# Altium project PCB_Project.PrjPcb
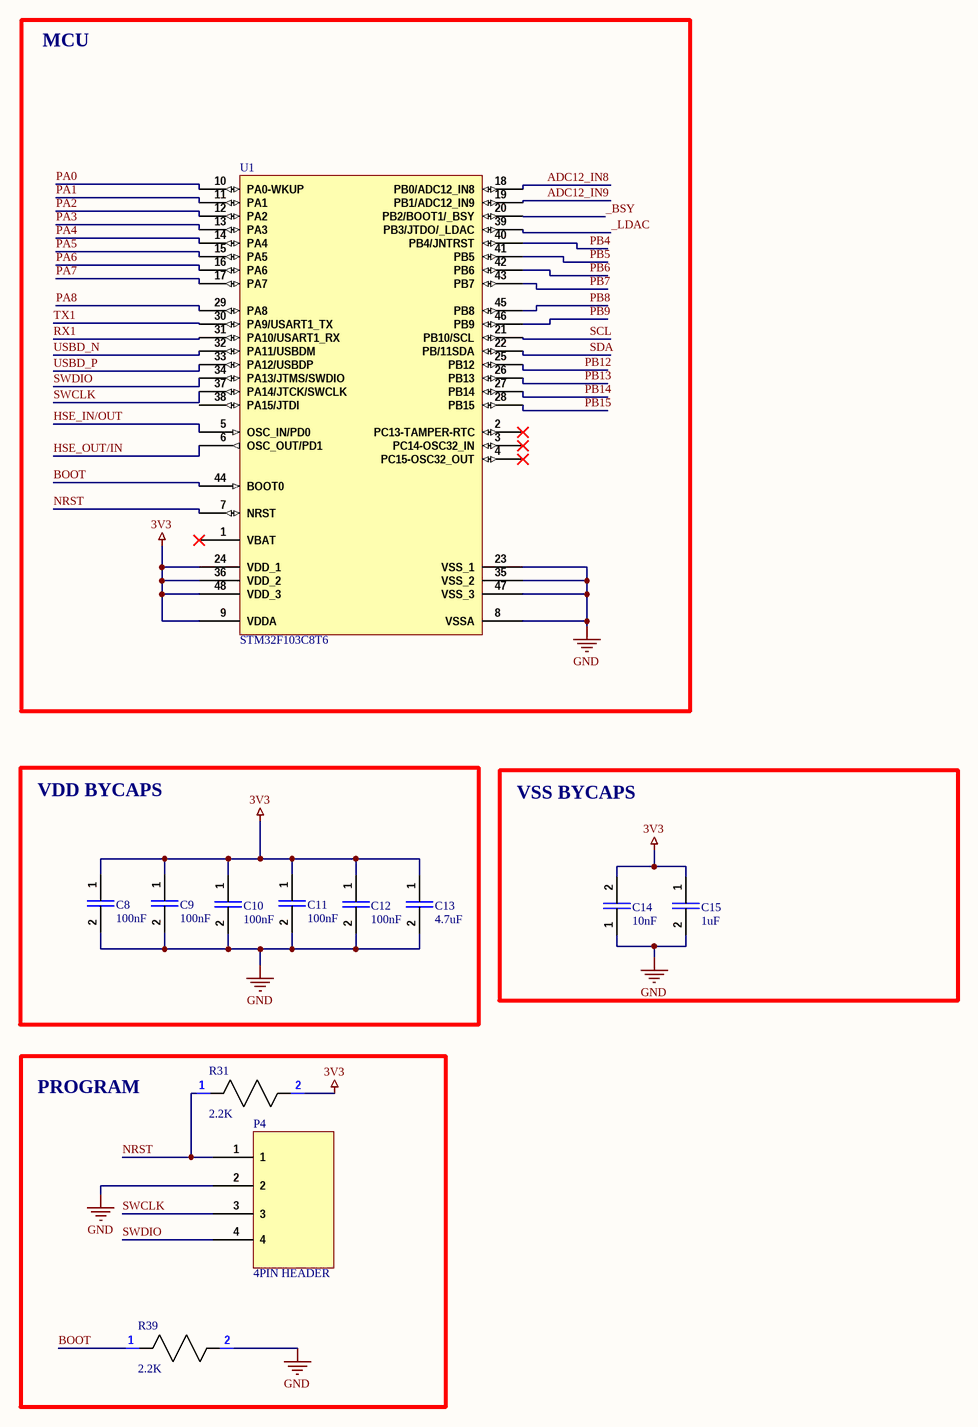
[diagram p0: MCU.SchDoc]
8 sheets, 153 parts. Net scope: global (net labels, ports and power ports of the same name join across sheets).
Board file: PCB1.PcbDoc
Sheets:
  MCU.SchDoc
  Power.SchDoc
  Oscillators.SchDoc
  RS232.SchDoc
  USB.SchDoc
  ADC.SchDoc
  DAC.SchDoc
  GPIO.SchDoc

## Sheet MCU.SchDoc
size A3; SheetNumber: 1; SheetTotal: 8

### Parts
C8  value 100nF  [0603 Cap]  (hidden comment: 0603 Capacitor)
C9  value 100nF  [0603 Cap]  (hidden comment: 0603 Capacitor)
C10  value 100nF  [0603 Cap]  (hidden comment: 0603 Capacitor)
C11  value 100nF  [0603 Cap]  (hidden comment: 0603 Capacitor)
C12  value 100nF  [0603 Cap]  (hidden comment: 0603 Capacitor)
C13  value 4.7uF  [0603 Cap]  (hidden comment: 0603 Capacitor)
C14  value 10nF  [0603 Cap]  (hidden comment: 0603 Capacitor)
C15  value 1uF  [0603 Cap]  (hidden comment: 0603 Capacitor)
P4  4PIN HEADER  [SM04B-SRSS-TB]
R31  value 2.2K  [0603 RES]  (hidden comment: Resistor)
R39  value 2.2K  [0603 RES]  (hidden comment: Resistor)
U1  STM32F103C8T6  [LQFP48_N]

### Blocks framed on the sheet
MCU: U1
VDD BYCAPS: C8-C13
VSS BYCAPS: C14 C15
PROGRAM: P4 R31 R39

### Nets
3V3: C8.1 C9.1 C10.1 C11.1 C12.1 C13.1 C14.2 C15.1 R31.2 U1.9(VDDA) U1.24(VDD_1) U1.36(VDD_2) U1.48(VDD_3)
GND: C8.2 C9.2 C10.2 C11.2 C12.2 C13.2 C14.1 C15.2 P4.2 R39.2 U1.8(VSSA) U1.23(VSS_1) U1.35(VSS_2) U1.47(VSS_3)
_BSY: U1.20(PB2/BOOT1/_BSY)
_LDAC: U1.39(PB3/JTDO/_LDAC)
ADC12_IN8: U1.18(PB0/ADC12_IN8)
ADC12_IN9: U1.19(PB1/ADC12_IN9)
BOOT: R39.1 U1.44(BOOT0)
HSE_IN/OUT: U1.5(OSC_IN/PD0)
HSE_OUT/IN: U1.6(OSC_OUT/PD1)
NRST: P4.1 R31.1 U1.7(NRST)
PA0: U1.10(PA0-WKUP)
PA1: U1.11(PA1)
PA2: U1.12(PA2)
PA3: U1.13(PA3)
PA4: U1.14(PA4)
PA5: U1.15(PA5)
PA6: U1.16(PA6)
PA7: U1.17(PA7)
PA8: U1.29(PA8)
PB4: U1.40(PB4/JNTRST)
PB5: U1.41(PB5)
PB6: U1.42(PB6)
PB7: U1.43(PB7)
PB8: U1.45(PB8)
PB9: U1.46(PB9)
PB12: U1.25(PB12)
PB13: U1.26(PB13)
PB14: U1.27(PB14)
PB15: U1.28(PB15)
RX1: U1.31(PA10/USART1_RX)
SCL: U1.21(PB10/SCL)
SDA: U1.22(PB/11SDA)
SWCLK: P4.3 U1.37(PA14/JTCK/SWCLK)
SWDIO: P4.4 U1.34(PA13/JTMS/SWDIO)
TX1: U1.30(PA9/USART1_TX)
USBD_N: U1.32(PA11/USBDM)
USBD_P: U1.33(PA12/USBDP)

Not connected (* = marked no-connect by the designer): U1 1(VBAT)* 2(PC13-TAMPER-RTC)* 3(PC14-OSC32_IN)* 4(PC15-OSC32_OUT)* 38(PA15/JTDI)

### Library data of the parts
C8-C15 = 0603 Cap: SMD 0603 (ceramic) capacitor; Manufacturer: Murata; Manufacturer Part Number: GRM21BR71C225KA12L; Multilayer: Yes; Tolerance  (fill in as +-): 10%; Rated DC Voltage (URdc): 16V; Temperature Characteristics Code: X7R; Supplier: Mouser; Supplier Part Number: 81-GRM21BR71C225KA2L; RoHS: Yes; Category: Ceramic Capacitors; Stock: 30148; Pricing: 1=0,3, 10=0,163, 50=0,163, 100=0,098, 1000=0,07, 10000=0,054 (USD); Mounting Technology: Surface Mount; Pins: 2; Package Shape: Rectangular; Terminal Finish: Nickel; Dielectric Material: Ceramic; Case/Package: 0805; Min Operating Temperature: -55°C; Max Operating Temperature: 125°C; JESD-609 Code: e3; Package Style: SMTMeter; Capacitor Type: Ceramic; Packaging: Tape and Reel; Tolerance (fill in as +-): 10%; Termination: Wraparound; Length: 2mm; Width: 1.25mm; Height: 1.25mm; Reach SVHC Compliant: Yes; RoHS Compliant: Yes; ComponentLink1URL: https://datasheet.ciiva.com:443/pdfs/VipMasterIC/IC/MURE/MURE-S-A0004349797/MURE-S-A0004361718-1.pdf?src-supplier=IHS+Markit; ComponentLink1Description: https://datasheet.ciiva.com:443/pdfs/VipMasterIC/IC/MURE/MURE-S-A0004349797/MURE-S-A0004361718-1.pdf?src-supplier=IHS+Markit; ComponentLink2URL: https://datasheet.ciiva.com/7937/608985-7937701.pdf?src-supplier=Element14; ComponentLink2Description: https://datasheet.ciiva.com/7937/608985-7937701.pdf?src-supplier=Element14
P4 = 4X HEADER
R31 R39 = 0603 Res: Can be used for SMD resistors
U1 = STM32F103C8T6: STM32 ARM-based 32-bit MCU with 64 Kbytes Flash, 48-pin LQFP, Industrial Temperature; Published: 30-May-2008; DatasheetVersion: rev6, Mar-2008; PackageVersion: Mar-2008; PackageReference: LQFP48; Publisher: Altium Limited; PackageDescription: 48-Pin Low-Profile Quad Flat Pack, 7 x 7 mm Body, 0.5 mm Pitch (LQFP48); ComponentLink1Description: Manufacturer Link; ComponentLink1URL: www.st.com/stm32; ComponentLink2Description: Datasheet; ComponentLink2URL: http://www.st.com/stonline/products/literature/ds/13587.pdf

## Sheet Power.SchDoc
size A4; SheetNumber: 2; SheetTotal: 8
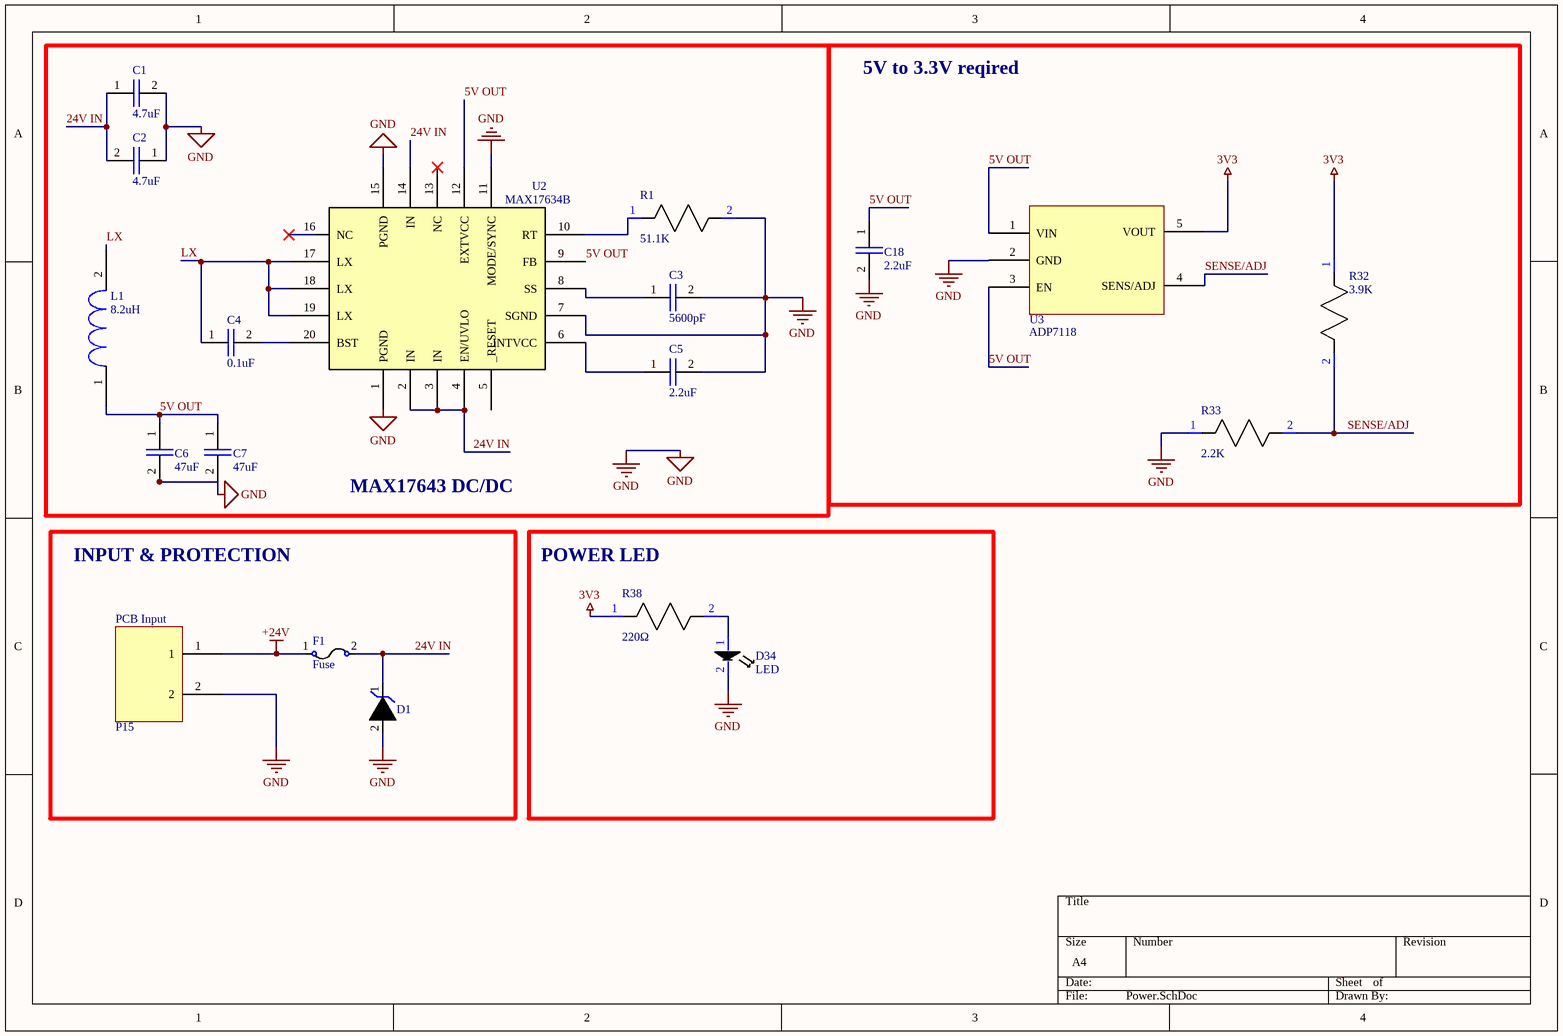
[diagram p1: Power.SchDoc]

### Parts
C1  value 4.7uF  [0603 Cap]  (hidden comment: 0603 Capacitor)
C2  value 4.7uF  [0603 Cap]  (hidden comment: 0603 Capacitor)
C3  value 5600pF  [0603 Cap]  (hidden comment: 0603 Capacitor)
C4  value 0.1uF  [0603 Cap]  (hidden comment: 0603 Capacitor)
C5  value 2.2uF  [0603 Cap]  (hidden comment: 0603 Capacitor)
C6  value 47uF  [0603 Cap]  (hidden comment: 0603 Capacitor)
C7  value 47uF  [0603 Cap]  (hidden comment: 0603 Capacitor)
C18  value 2.2uF  [0603 Cap]  (hidden comment: 0603 Capacitor)
D1  TVS  [TVS DIODE]  (value not drawn)
D34  LED  [0805 LED]
F1  Fuse  [0805 Fuse]
L1  8.2uH  [XAL6060]
P15  PCB Input  [WR-TBL 322 2H]
R1  value 51.1K  [0603 RES]  (hidden comment: Resistor)
R32  value 3.9K  [0603 RES]  (hidden comment: Resistor)
R33  value 2.2K  [0603 RES]  (hidden comment: Resistor)
R38  value 220Ω  [0603 RES]  (hidden comment: Resistor)
U2  MAX17634B  [20-PIN TQFN]
U3  ADP7118  [5-PIN TSOT]

### Blocks framed on the sheet
MAX17643 DC/DC: C1-C7 L1 R1 U2
5V to 3.3V reqired: C18 R32 R33 U3
INPUT & PROTECTION: D1 F1 P15
POWER LED: D34 R38

### Nets
3V3: R32.1 R38.1 U3.5(VOUT)
5V OUT: C6.1 C7.1 C18.1 L1.1 U2.9(FB) U2.12(EXTVCC) U3.1(VIN) U3.3(EN)
+24V: F1.1 P15.1
GND: C1.2 C2.1 C3.2 C5.2 C6.2 C7.2 C18.2 D1.2 D34.2 P15.2 R1.2 R33.1 U2.1(PGND) U2.7(SGND) U2.11(MODE/SYNC) U2.15(PGND) U3.2(GND)
24V IN: C1.1 C2.2 D1.1 F1.2 U2.2(IN) U2.3(IN) U2.4(EN/UVLO) U2.14(IN)
LX: C4.1 L1.2 U2.17(LX) U2.18(LX) U2.19(LX)
SENSE/ADJ: R32.2 R33.2 U3.4(SENS/ADJ)
NetC3_1: C3.1 U2.8(SS)
NetC4_2: C4.2 U2.20(BST)
NetC5_1: C5.1 U2.6(INTVCC)
NetD34_1: D34.1 R38.2
NetR1_1: R1.1 U2.10(RT)

Not connected (* = marked no-connect by the designer): U2 5(_RESET) 13(NC)* 16(NC)*

### Library data of the parts
C1-C7 C18 = 0603 Cap: as C8 on sheet MCU; Supplier: Mouser; Supplier Part Number: 81-GRM21BR71C225KA2L; RoHS: Yes; Category: Ceramic Capacitors; Stock: 30148; Pricing: 1=0,3, 10=0,163, 50=0,163, 100=0,098, 1000=0,07, 10000=0,054 (USD); Mounting Technology: Surface Mount; Pins: 2; Package Shape: Rectangular; Terminal Finish: Nickel; Dielectric Material: Ceramic; Case/Package: 0805; Min Operating Temperature: -55°C; Max Operating Temperature: 125°C; JESD-609 Code: e3; Package Style: SMTMeter; Capacitor Type: Ceramic; Packaging: Tape and Reel; Tolerance (fill in as +-): 10%; Termination: Wraparound; Length: 2mm; Width: 1.25mm; Height: 1.25mm; Reach SVHC Compliant: Yes; RoHS Compliant: Yes; ComponentLink1URL: https://datasheet.ciiva.com:443/pdfs/VipMasterIC/IC/MURE/MURE-S-A0004349797/MURE-S-A0004361718-1.pdf?src-supplier=IHS+Markit; ComponentLink1Description: https://datasheet.ciiva.com:443/pdfs/VipMasterIC/IC/MURE/MURE-S-A0004349797/MURE-S-A0004361718-1.pdf?src-supplier=IHS+Markit; ComponentLink2URL: https://datasheet.ciiva.com/7937/608985-7937701.pdf?src-supplier=Element14; ComponentLink2Description: https://datasheet.ciiva.com/7937/608985-7937701.pdf?src-supplier=Element14
D1 = TVS Diode: Schematic for TVS diode
F1 = Fuse: 0805 Fuse
L1 = Power Inductor: XAL6060 preferred
P15 = 322-2H: 322 series 2 pin header
R1 R32 R33 R38 = 0603 Res: Can be used for SMD resistors
U2 = 20-PIN TQFN: 20-PIN TSOT
U3 = 5-PIN TSOT: Schematic for all 5 pin TSOT

## Sheet Oscillators.SchDoc
size A4; SheetNumber: 3; SheetTotal: 8
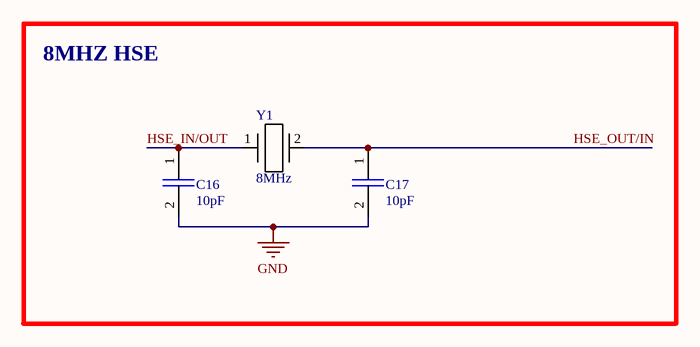
[diagram p2: Oscillators.SchDoc]

### Parts
C16  value 10pF  [0603 Cap]  (hidden comment: 0603 Capacitor)
C17  value 10pF  [0603 Cap]  (hidden comment: 0603 Capacitor)
Y1  value 8MHz  [ABM3 2PIN SMD]  (hidden comment: XTAL)

### Blocks framed on the sheet
8MHZ HSE: C16 C17 Y1

### Nets
GND: C16.2 C17.2
HSE_IN/OUT: C16.1 Y1.1
HSE_OUT/IN: C17.1 Y1.2

### Library data of the parts
C16 C17 = 0603 Cap: as C8 on sheet MCU; Supplier: Mouser; Supplier Part Number: 81-GRM21BR71C225KA2L; RoHS: Yes; Category: Ceramic Capacitors; Stock: 30148; Pricing: 1=0,3, 10=0,163, 50=0,163, 100=0,098, 1000=0,07, 10000=0,054 (USD); Mounting Technology: Surface Mount; Pins: 2; Package Shape: Rectangular; Terminal Finish: Nickel; Dielectric Material: Ceramic; Case/Package: 0805; Min Operating Temperature: -55°C; Max Operating Temperature: 125°C; JESD-609 Code: e3; Package Style: SMTMeter; Capacitor Type: Ceramic; Packaging: Tape and Reel; Tolerance (fill in as +-): 10%; Termination: Wraparound; Length: 2mm; Width: 1.25mm; Height: 1.25mm; Reach SVHC Compliant: Yes; RoHS Compliant: Yes; ComponentLink1URL: https://datasheet.ciiva.com:443/pdfs/VipMasterIC/IC/MURE/MURE-S-A0004349797/MURE-S-A0004361718-1.pdf?src-supplier=IHS+Markit; ComponentLink1Description: https://datasheet.ciiva.com:443/pdfs/VipMasterIC/IC/MURE/MURE-S-A0004349797/MURE-S-A0004361718-1.pdf?src-supplier=IHS+Markit; ComponentLink2URL: https://datasheet.ciiva.com/7937/608985-7937701.pdf?src-supplier=Element14; ComponentLink2Description: https://datasheet.ciiva.com/7937/608985-7937701.pdf?src-supplier=Element14
Y1 = XTAL: XTAL schematic. Footprint available for many packages

## Sheet RS232.SchDoc
size A3; SheetNumber: 4; SheetTotal: 8
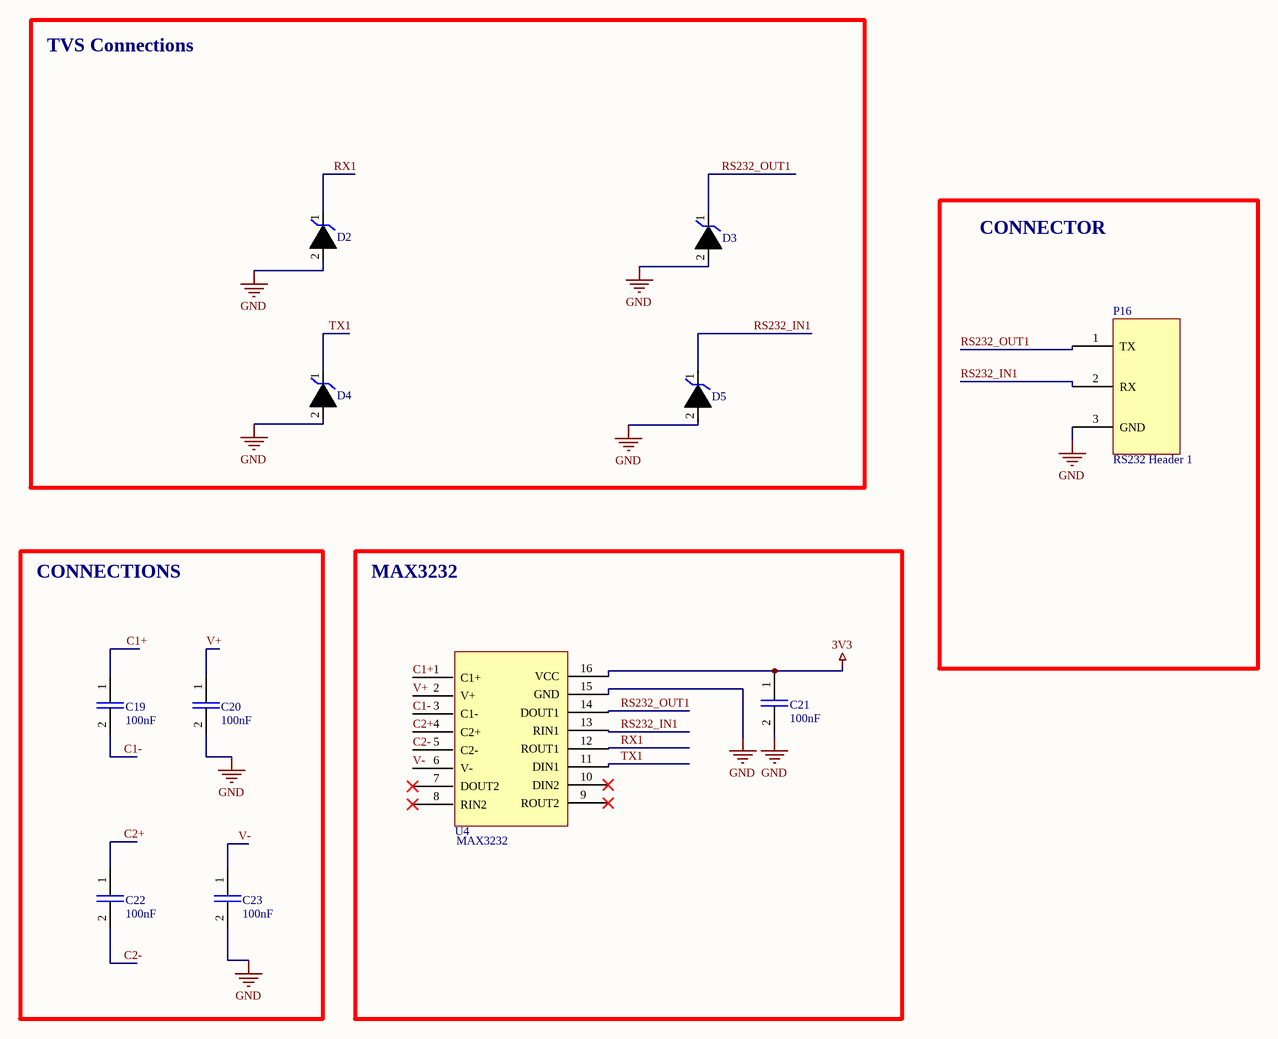
[diagram p3: RS232.SchDoc]

### Parts
C19  value 100nF  [0603 Cap]  (hidden comment: 0603 Capacitor)
C20  value 100nF  [0603 Cap]  (hidden comment: 0603 Capacitor)
C21  value 100nF  [0603 Cap]  (hidden comment: 0603 Capacitor)
C22  value 100nF  [0603 Cap]  (hidden comment: 0603 Capacitor)
C23  value 100nF  [0603 Cap]  (hidden comment: 0603 Capacitor)
D2  TVS  [TVS DIODE]  (value not drawn)
D3  TVS  [TVS DIODE]  (value not drawn)
D4  TVS  [TVS DIODE]  (value not drawn)
D5  TVS  [TVS DIODE]  (value not drawn)
P16  RS232 Header 1  [WR-TBL 322 3H]
U4  MAX3232  [16-PIN SOIC]

### Blocks framed on the sheet
TVS Connections: D2-D5
CONNECTOR: P16
CONNECTIONS: C19 C20 C22 C23
MAX3232: C21 U4

### Nets
3V3: C21.1 U4.16(VCC)
GND: C20.2 C21.2 C23.2 D2.2 D3.2 D4.2 D5.2 P16.3(GND) U4.15(GND)
C1+: C19.1 U4.1(C1+)
C1-: C19.2 U4.3(C1-)
C2+: C22.1 U4.4(C2+)
C2-: C22.2 U4.5(C2-)
RS232_IN1: D5.1 P16.2(RX) U4.13(RIN1)
RS232_OUT1: D3.1 P16.1(TX) U4.14(DOUT1)
RX1: D2.1 U4.12(ROUT1)
TX1: D4.1 U4.11(DIN1)
V+: C20.1 U4.2(V+)
V-: C23.1 U4.6(V-)

Not connected (* = marked no-connect by the designer): U4 7(DOUT2)* 8(RIN2)* 9(ROUT2)* 10(DIN2)*

### Library data of the parts
C19-C23 = 0603 Cap: as C8 on sheet MCU; Supplier: Mouser; Supplier Part Number: 81-GRM21BR71C225KA2L; RoHS: Yes; Category: Ceramic Capacitors; Stock: 30148; Pricing: 1=0,3, 10=0,163, 50=0,163, 100=0,098, 1000=0,07, 10000=0,054 (USD); Mounting Technology: Surface Mount; Pins: 2; Package Shape: Rectangular; Terminal Finish: Nickel; Dielectric Material: Ceramic; Case/Package: 0805; Min Operating Temperature: -55°C; Max Operating Temperature: 125°C; JESD-609 Code: e3; Package Style: SMTMeter; Capacitor Type: Ceramic; Packaging: Tape and Reel; Tolerance (fill in as +-): 10%; Termination: Wraparound; Length: 2mm; Width: 1.25mm; Height: 1.25mm; Reach SVHC Compliant: Yes; RoHS Compliant: Yes; ComponentLink1URL: https://datasheet.ciiva.com:443/pdfs/VipMasterIC/IC/MURE/MURE-S-A0004349797/MURE-S-A0004361718-1.pdf?src-supplier=IHS+Markit; ComponentLink1Description: https://datasheet.ciiva.com:443/pdfs/VipMasterIC/IC/MURE/MURE-S-A0004349797/MURE-S-A0004361718-1.pdf?src-supplier=IHS+Markit; ComponentLink2URL: https://datasheet.ciiva.com/7937/608985-7937701.pdf?src-supplier=Element14; ComponentLink2Description: https://datasheet.ciiva.com/7937/608985-7937701.pdf?src-supplier=Element14
D2-D5 = TVS Diode: Schematic for TVS diode
P16 = 322-3H: 322 Series 3 pin header
U4 = 16-PIN SOIC: 16-Pin SOIC package IC schematic

## Sheet USB.SchDoc
size A4; SheetNumber: 5; SheetTotal: 8
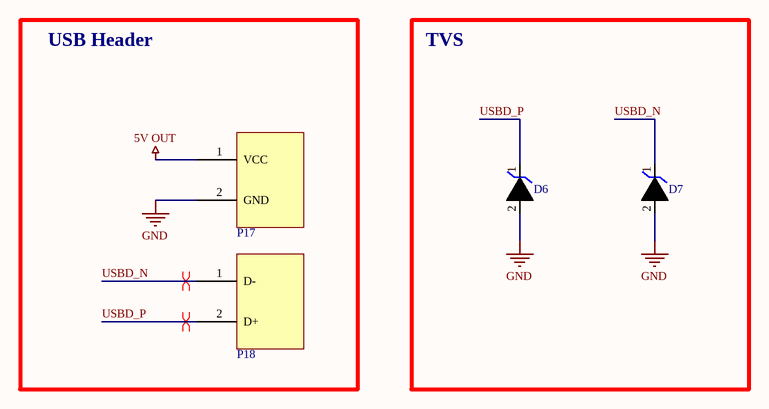
[diagram p4: USB.SchDoc]

### Parts
D6  TVS  [TVS DIODE]  (value not drawn)
D7  TVS  [TVS DIODE]  (value not drawn)
P17  2-Pin Header  [WR-TBL 322 2H]  (value not drawn)
P18  2-Pin Header  [WR-TBL 322 2H]  (value not drawn)

### Blocks framed on the sheet
USB Header: P17 P18
TVS: D6 D7

### Nets
5V OUT: P17.1(VCC)
GND: D6.2 D7.2 P17.2(GND)
USBD_N: D7.1 P18.1(D-)
USBD_P: D6.1 P18.2(D+)

### Layout directives
differential pair: USBD_N, USBD_P

### Library data of the parts
D6 D7 = TVS Diode: Schematic for TVS diode
P17 P18 = 322-2H: 322 series 2 pin header

## Sheet ADC.SchDoc
size A4; SheetNumber: 6; SheetTotal: 8
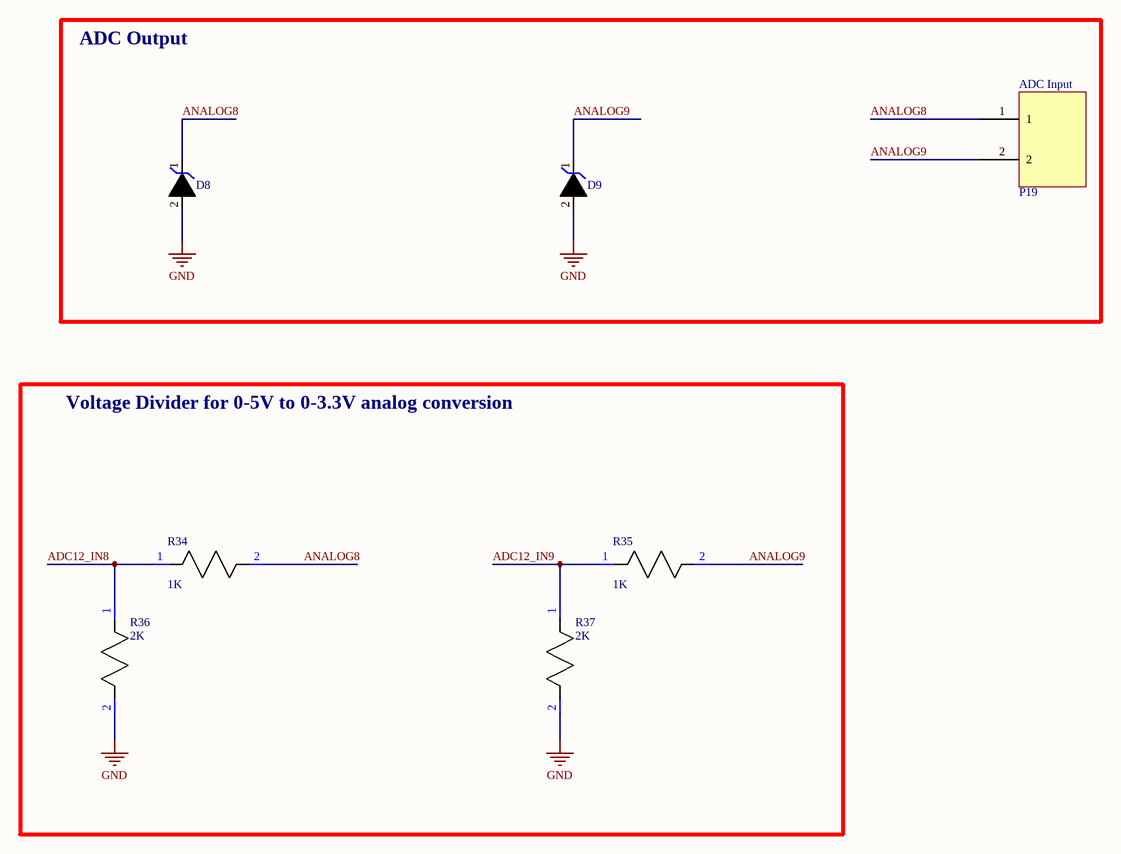
[diagram p5: ADC.SchDoc]

### Parts
D8  TVS  [TVS DIODE]  (value not drawn)
D9  TVS  [TVS DIODE]  (value not drawn)
P19  ADC Input  [WR-TBL 322 2H]
R34  value 1K  [0603 RES]  (hidden comment: Resistor)
R35  value 1K  [0603 RES]  (hidden comment: Resistor)
R36  value 2K  [0603 RES]  (hidden comment: Resistor)
R37  value 2K  [0603 RES]  (hidden comment: Resistor)

### Blocks framed on the sheet
ADC Output: D8 D9 P19
Voltage Divider for 0-5V to 0-3.3V analog conversion: R34-R37

### Nets
GND: D8.2 D9.2 R36.2 R37.2
ADC12_IN8: R34.1 R36.1
ADC12_IN9: R35.1 R37.1
ANALOG8: D8.1 P19.1 R34.2
ANALOG9: D9.1 P19.2 R35.2

### Library data of the parts
D8 D9 = TVS Diode: Schematic for TVS diode
P19 = 322-2H: 322 series 2 pin header
R34-R37 = 0603 Res: Can be used for SMD resistors

## Sheet DAC.SchDoc
size A4; SheetNumber: 7; SheetTotal: 8
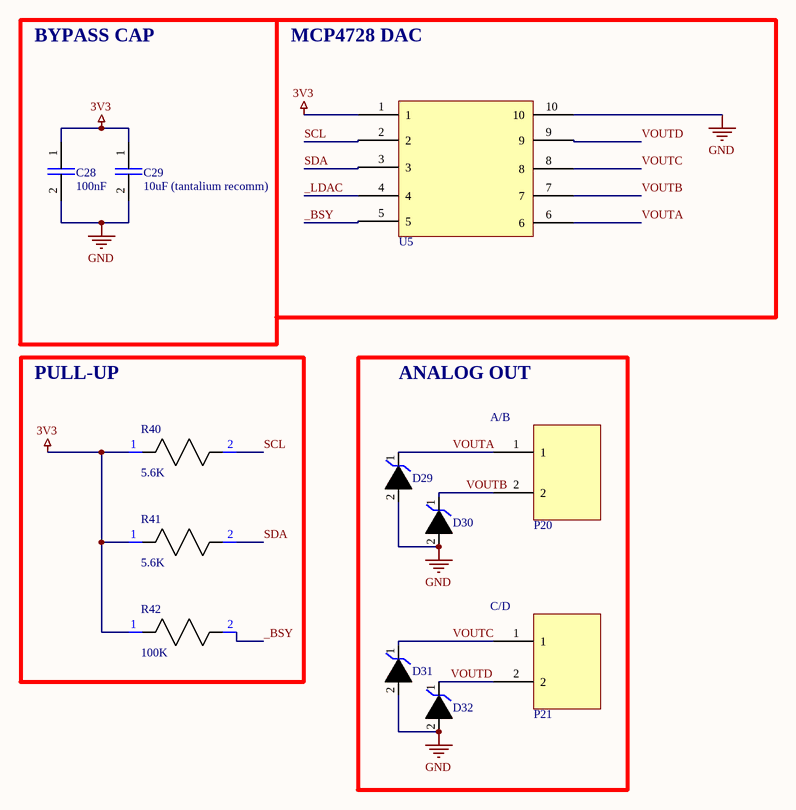
[diagram p6: DAC.SchDoc]

### Parts
C28  value 100nF  [0603 Cap]  (hidden comment: 0603 Capacitor)
C29  value 10uF (tantalium recomm)  [0603 Cap]  (hidden comment: 0603 Capacitor)
D29  TVS  [TVS DIODE]  (value not drawn)
D30  TVS  [TVS DIODE]  (value not drawn)
D31  TVS  [TVS DIODE]  (value not drawn)
D32  TVS  [TVS DIODE]  (value not drawn)
P20  A/B  [WR-TBL 322 2H]
P21  C/D  [WR-TBL 322 2H]
R40  value 5.6K  [0603 RES]  (hidden comment: Resistor)
R41  value 5.6K  [0603 RES]  (hidden comment: Resistor)
R42  value 100K  [0603 RES]  (hidden comment: Resistor)
U5  MCP4728  [10-PIN MSOP]  (value not drawn)

### Blocks framed on the sheet
BYPASS CAP: C28 C29
MCP4728 DAC: U5
PULL-UP: R40-R42
ANALOG OUT: D29-D32 P20 P21

### Nets
3V3: C28.1 C29.1 R40.1 R41.1 R42.1 U5.1
GND: C28.2 C29.2 D29.2 D30.2 D31.2 D32.2 U5.10
_BSY: R42.2 U5.5
_LDAC: U5.4
SCL: R40.2 U5.2
SDA: R41.2 U5.3
VOUTA: D29.1 P20.1 U5.6
VOUTB: D30.1 P20.2 U5.7
VOUTC: D31.1 P21.1 U5.8
VOUTD: D32.1 P21.2 U5.9

### Library data of the parts
C28 C29 = 0603 Cap: as C8 on sheet MCU; Supplier: Mouser; Supplier Part Number: 81-GRM21BR71C225KA2L; RoHS: Yes; Category: Ceramic Capacitors; Stock: 30148; Pricing: 1=0,3, 10=0,163, 50=0,163, 100=0,098, 1000=0,07, 10000=0,054 (USD); Mounting Technology: Surface Mount; Pins: 2; Package Shape: Rectangular; Terminal Finish: Nickel; Dielectric Material: Ceramic; Case/Package: 0805; Min Operating Temperature: -55°C; Max Operating Temperature: 125°C; JESD-609 Code: e3; Package Style: SMTMeter; Capacitor Type: Ceramic; Packaging: Tape and Reel; Tolerance (fill in as +-): 10%; Termination: Wraparound; Length: 2mm; Width: 1.25mm; Height: 1.25mm; Reach SVHC Compliant: Yes; RoHS Compliant: Yes; ComponentLink1URL: https://datasheet.ciiva.com:443/pdfs/VipMasterIC/IC/MURE/MURE-S-A0004349797/MURE-S-A0004361718-1.pdf?src-supplier=IHS+Markit; ComponentLink1Description: https://datasheet.ciiva.com:443/pdfs/VipMasterIC/IC/MURE/MURE-S-A0004349797/MURE-S-A0004361718-1.pdf?src-supplier=IHS+Markit; ComponentLink2URL: https://datasheet.ciiva.com/7937/608985-7937701.pdf?src-supplier=Element14; ComponentLink2Description: https://datasheet.ciiva.com/7937/608985-7937701.pdf?src-supplier=Element14
D29-D32 = TVS Diode: Schematic for TVS diode
P20 P21 = 322-2H: 322 series 2 pin header
R40-R42 = 0603 Res: Can be used for SMD resistors
U5 = 10-PIN MSOP

## Sheet GPIO.SchDoc
size A3; SheetNumber: 8; SheetTotal: 8
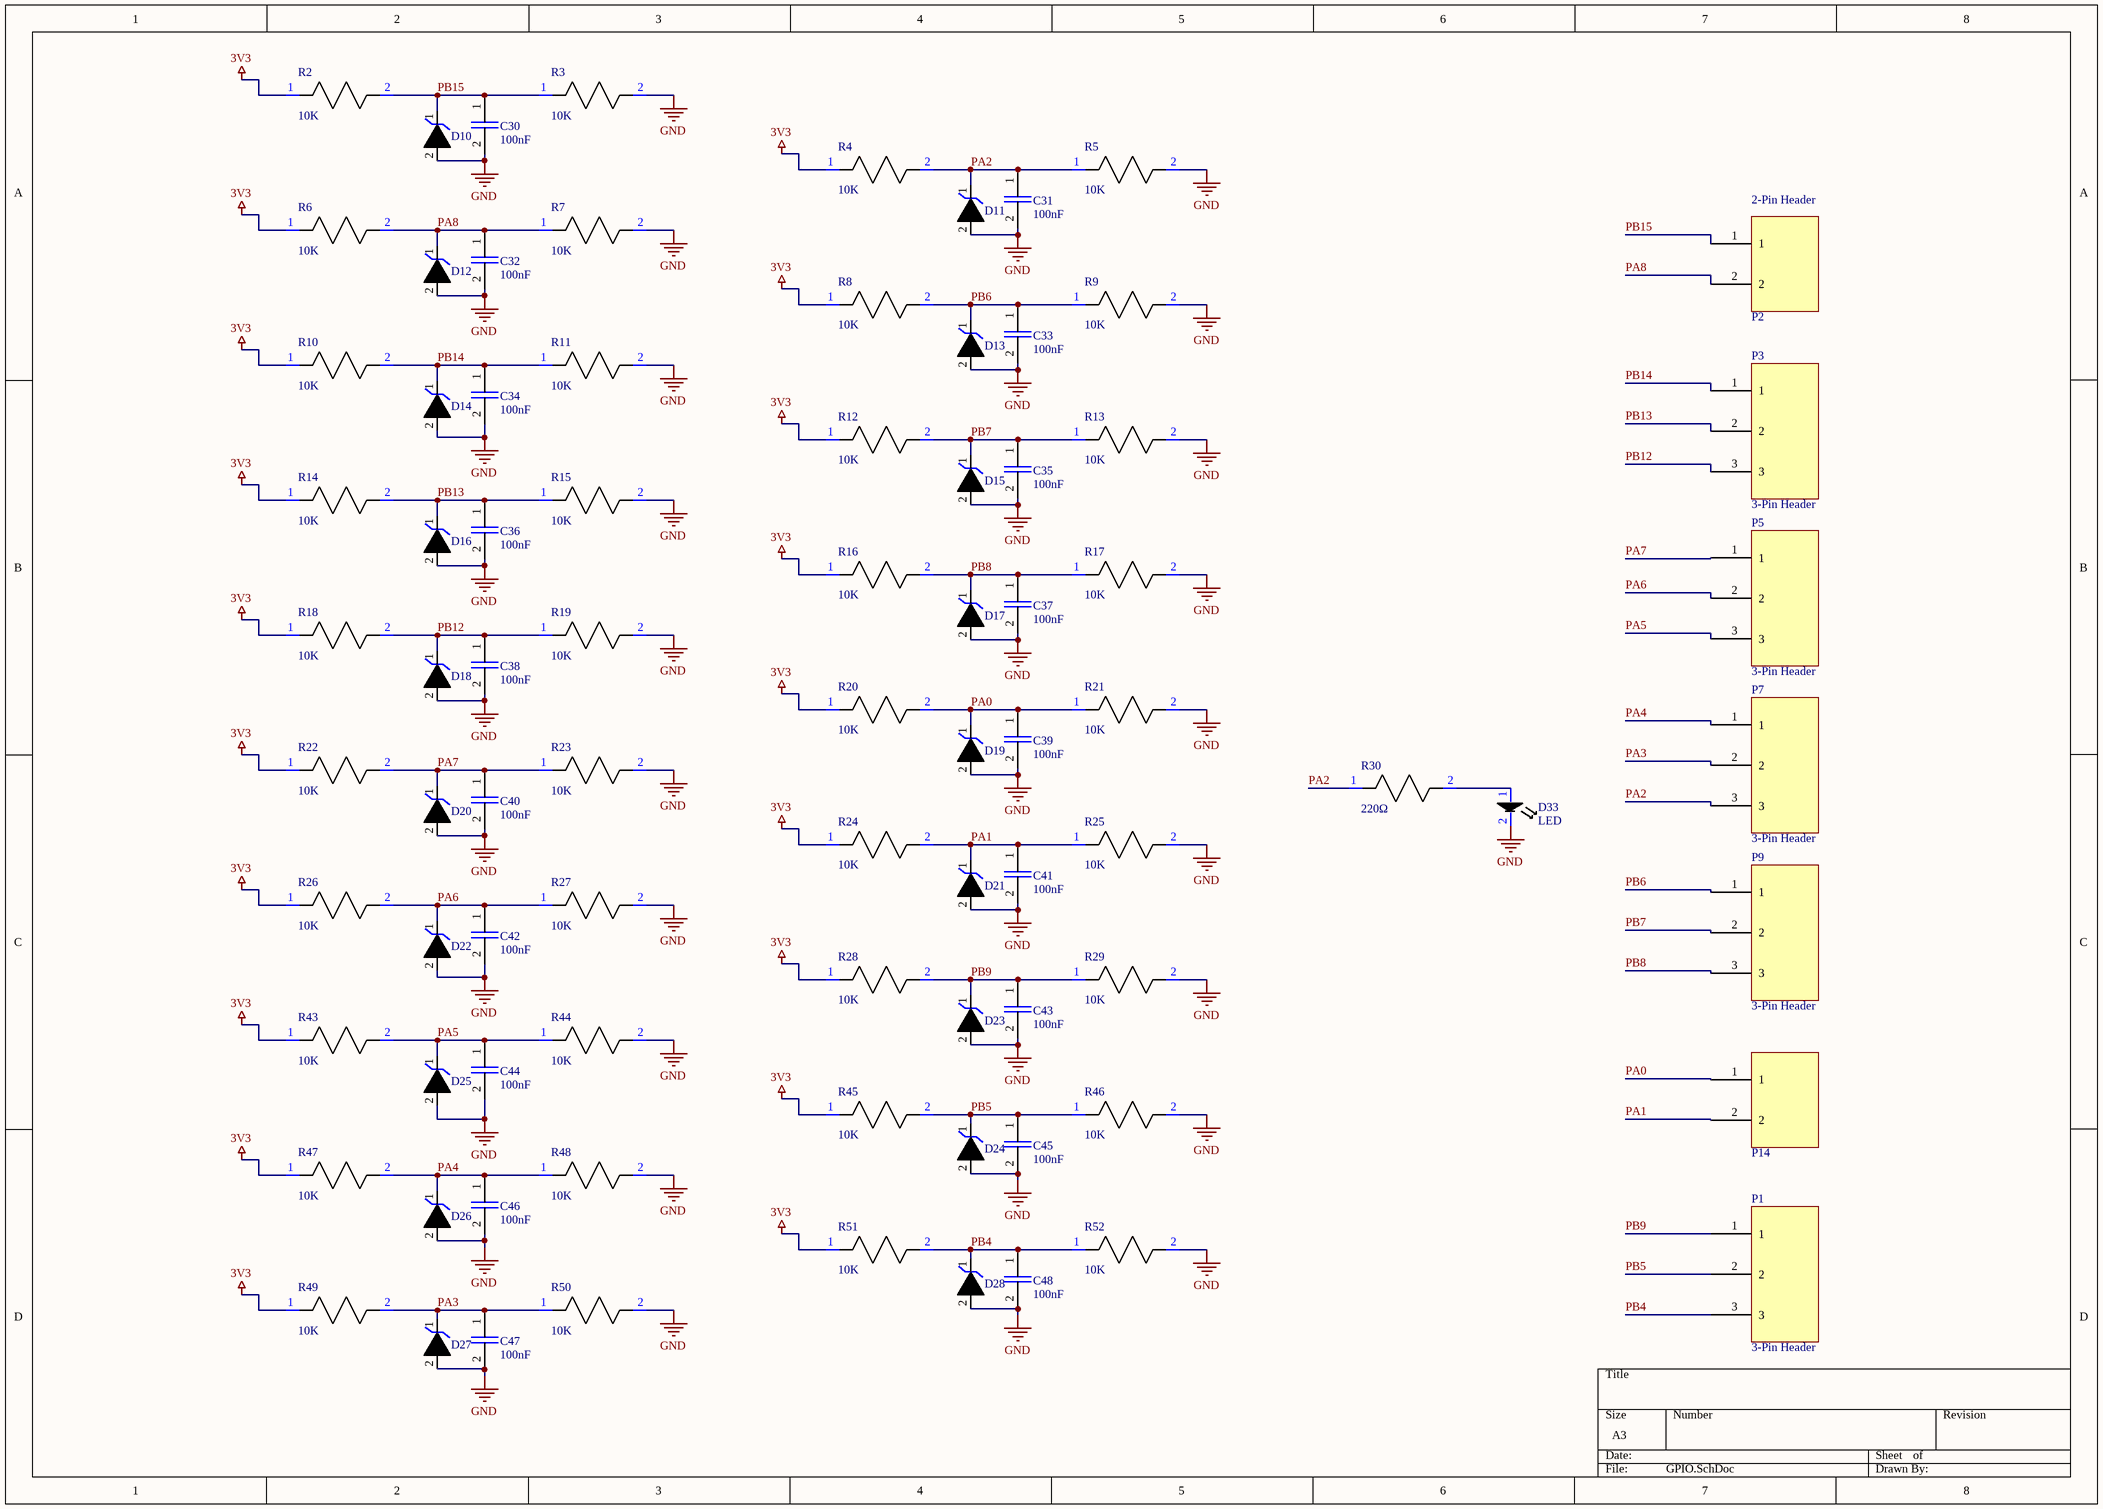
[diagram p7: GPIO.SchDoc]

### Parts
C30  value 100nF  [0603 Cap]  (hidden comment: 0603 Capacitor)
C31  value 100nF  [0603 Cap]  (hidden comment: 0603 Capacitor)
C32  value 100nF  [0603 Cap]  (hidden comment: 0603 Capacitor)
C33  value 100nF  [0603 Cap]  (hidden comment: 0603 Capacitor)
C34  value 100nF  [0603 Cap]  (hidden comment: 0603 Capacitor)
C35  value 100nF  [0603 Cap]  (hidden comment: 0603 Capacitor)
C36  value 100nF  [0603 Cap]  (hidden comment: 0603 Capacitor)
C37  value 100nF  [0603 Cap]  (hidden comment: 0603 Capacitor)
C38  value 100nF  [0603 Cap]  (hidden comment: 0603 Capacitor)
C39  value 100nF  [0603 Cap]  (hidden comment: 0603 Capacitor)
C40  value 100nF  [0603 Cap]  (hidden comment: 0603 Capacitor)
C41  value 100nF  [0603 Cap]  (hidden comment: 0603 Capacitor)
C42  value 100nF  [0603 Cap]  (hidden comment: 0603 Capacitor)
C43  value 100nF  [0603 Cap]  (hidden comment: 0603 Capacitor)
C44  value 100nF  [0603 Cap]  (hidden comment: 0603 Capacitor)
C45  value 100nF  [0603 Cap]  (hidden comment: 0603 Capacitor)
C46  value 100nF  [0603 Cap]  (hidden comment: 0603 Capacitor)
C47  value 100nF  [0603 Cap]  (hidden comment: 0603 Capacitor)
C48  value 100nF  [0603 Cap]  (hidden comment: 0603 Capacitor)
D10  TVS  [TVS DIODE]  (value not drawn)
D11  TVS  [TVS DIODE]  (value not drawn)
D12  TVS  [TVS DIODE]  (value not drawn)
D13  TVS  [TVS DIODE]  (value not drawn)
D14  TVS  [TVS DIODE]  (value not drawn)
D15  TVS  [TVS DIODE]  (value not drawn)
D16  TVS  [TVS DIODE]  (value not drawn)
D17  TVS  [TVS DIODE]  (value not drawn)
D18  TVS  [TVS DIODE]  (value not drawn)
D19  TVS  [TVS DIODE]  (value not drawn)
D20  TVS  [TVS DIODE]  (value not drawn)
D21  TVS  [TVS DIODE]  (value not drawn)
D22  TVS  [TVS DIODE]  (value not drawn)
D23  TVS  [TVS DIODE]  (value not drawn)
D24  TVS  [TVS DIODE]  (value not drawn)
D25  TVS  [TVS DIODE]  (value not drawn)
D26  TVS  [TVS DIODE]  (value not drawn)
D27  TVS  [TVS DIODE]  (value not drawn)
D28  TVS  [TVS DIODE]  (value not drawn)
D33  LED  [0805 LED]
P1  3-Pin Header  [WR-TBL 322 3H]
P2  2-Pin Header  [WR-TBL 322 2H]
P3  3-Pin Header  [WR-TBL 322 3H]
P5  3-Pin Header  [WR-TBL 322 3H]
P7  3-Pin Header  [WR-TBL 322 3H]
P9  3-Pin Header  [WR-TBL 322 3H]
P14  2-Pin Header  [WR-TBL 322 2H]  (value not drawn)
R2  value 10K  [0603 RES]  (hidden comment: Resistor)
R3  value 10K  [0603 RES]  (hidden comment: Resistor)
R4  value 10K  [0603 RES]  (hidden comment: Resistor)
R5  value 10K  [0603 RES]  (hidden comment: Resistor)
R6  value 10K  [0603 RES]  (hidden comment: Resistor)
R7  value 10K  [0603 RES]  (hidden comment: Resistor)
R8  value 10K  [0603 RES]  (hidden comment: Resistor)
R9  value 10K  [0603 RES]  (hidden comment: Resistor)
R10  value 10K  [0603 RES]  (hidden comment: Resistor)
R11  value 10K  [0603 RES]  (hidden comment: Resistor)
R12  value 10K  [0603 RES]  (hidden comment: Resistor)
R13  value 10K  [0603 RES]  (hidden comment: Resistor)
R14  value 10K  [0603 RES]  (hidden comment: Resistor)
R15  value 10K  [0603 RES]  (hidden comment: Resistor)
R16  value 10K  [0603 RES]  (hidden comment: Resistor)
R17  value 10K  [0603 RES]  (hidden comment: Resistor)
R18  value 10K  [0603 RES]  (hidden comment: Resistor)
R19  value 10K  [0603 RES]  (hidden comment: Resistor)
R20  value 10K  [0603 RES]  (hidden comment: Resistor)
R21  value 10K  [0603 RES]  (hidden comment: Resistor)
R22  value 10K  [0603 RES]  (hidden comment: Resistor)
R23  value 10K  [0603 RES]  (hidden comment: Resistor)
R24  value 10K  [0603 RES]  (hidden comment: Resistor)
R25  value 10K  [0603 RES]  (hidden comment: Resistor)
R26  value 10K  [0603 RES]  (hidden comment: Resistor)
R27  value 10K  [0603 RES]  (hidden comment: Resistor)
R28  value 10K  [0603 RES]  (hidden comment: Resistor)
R29  value 10K  [0603 RES]  (hidden comment: Resistor)
R30  value 220Ω  [0603 RES]  (hidden comment: Resistor)
R43  value 10K  [0603 RES]  (hidden comment: Resistor)
R44  value 10K  [0603 RES]  (hidden comment: Resistor)
R45  value 10K  [0603 RES]  (hidden comment: Resistor)
R46  value 10K  [0603 RES]  (hidden comment: Resistor)
R47  value 10K  [0603 RES]  (hidden comment: Resistor)
R48  value 10K  [0603 RES]  (hidden comment: Resistor)
R49  value 10K  [0603 RES]  (hidden comment: Resistor)
R50  value 10K  [0603 RES]  (hidden comment: Resistor)
R51  value 10K  [0603 RES]  (hidden comment: Resistor)
R52  value 10K  [0603 RES]  (hidden comment: Resistor)

### Nets
3V3: R2.1 R4.1 R6.1 R8.1 R10.1 R12.1 R14.1 R16.1 R18.1 R20.1 R22.1 R24.1 R26.1 R28.1 R43.1 R45.1 R47.1 R49.1 R51.1
GND: C30.2 C31.2 C32.2 C33.2 C34.2 C35.2 C36.2 C37.2 C38.2 C39.2 C40.2 C41.2 C42.2 C43.2 C44.2 C45.2 C46.2 C47.2 C48.2 D10.2 D11.2 D12.2 D13.2 D14.2 D15.2 D16.2 D17.2 D18.2 D19.2 D20.2 D21.2 D22.2 D23.2 D24.2 D25.2 D26.2 D27.2 D28.2 D33.2 R3.2 R5.2 R7.2 R9.2 R11.2 R13.2 R15.2 R17.2 R19.2 R21.2 R23.2 R25.2 R27.2 R29.2 R44.2 R46.2 R48.2 R50.2 R52.2
PA0: C39.1 D19.1 P14.1 R20.2 R21.1
PA1: C41.1 D21.1 P14.2 R24.2 R25.1
PA2: C31.1 D11.1 P7.3 R4.2 R5.1 R30.1
PA3: C47.1 D27.1 P7.2 R49.2 R50.1
PA4: C46.1 D26.1 P7.1 R47.2 R48.1
PA5: C44.1 D25.1 P5.3 R43.2 R44.1
PA6: C42.1 D22.1 P5.2 R26.2 R27.1
PA7: C40.1 D20.1 P5.1 R22.2 R23.1
PA8: C32.1 D12.1 P2.2 R6.2 R7.1
PB4: C48.1 D28.1 P1.3 R51.2 R52.1
PB5: C45.1 D24.1 P1.2 R45.2 R46.1
PB6: C33.1 D13.1 P9.1 R8.2 R9.1
PB7: C35.1 D15.1 P9.2 R12.2 R13.1
PB8: C37.1 D17.1 P9.3 R16.2 R17.1
PB9: C43.1 D23.1 P1.1 R28.2 R29.1
PB12: C38.1 D18.1 P3.3 R18.2 R19.1
PB13: C36.1 D16.1 P3.2 R14.2 R15.1
PB14: C34.1 D14.1 P3.1 R10.2 R11.1
PB15: C30.1 D10.1 P2.1 R2.2 R3.1
NetD33_1: D33.1 R30.2

### Library data of the parts
C30-C48 = 0603 Cap: as C8 on sheet MCU; Supplier: Mouser; Supplier Part Number: 81-GRM21BR71C225KA2L; RoHS: Yes; Category: Ceramic Capacitors; Stock: 30148; Pricing: 1=0,3, 10=0,163, 50=0,163, 100=0,098, 1000=0,07, 10000=0,054 (USD); Mounting Technology: Surface Mount; Pins: 2; Package Shape: Rectangular; Terminal Finish: Nickel; Dielectric Material: Ceramic; Case/Package: 0805; Min Operating Temperature: -55°C; Max Operating Temperature: 125°C; JESD-609 Code: e3; Package Style: SMTMeter; Capacitor Type: Ceramic; Packaging: Tape and Reel; Tolerance (fill in as +-): 10%; Termination: Wraparound; Length: 2mm; Width: 1.25mm; Height: 1.25mm; Reach SVHC Compliant: Yes; RoHS Compliant: Yes; ComponentLink1URL: https://datasheet.ciiva.com:443/pdfs/VipMasterIC/IC/MURE/MURE-S-A0004349797/MURE-S-A0004361718-1.pdf?src-supplier=IHS+Markit; ComponentLink1Description: https://datasheet.ciiva.com:443/pdfs/VipMasterIC/IC/MURE/MURE-S-A0004349797/MURE-S-A0004361718-1.pdf?src-supplier=IHS+Markit; ComponentLink2URL: https://datasheet.ciiva.com/7937/608985-7937701.pdf?src-supplier=Element14; ComponentLink2Description: https://datasheet.ciiva.com/7937/608985-7937701.pdf?src-supplier=Element14
D10-D28 = TVS Diode: Schematic for TVS diode
P1 P3 P5 P7 P9 = 322-3H: 322 Series 3 pin header
P2 P14 = 322-2H: 322 series 2 pin header
R2-R30 R43-R52 = 0603 Res: Can be used for SMD resistors

## Nets that join several sheets
3V3: MCU (13 pins), Power (R32.1 R38.1 U3.5), RS232 (C21.1 U4.16), DAC (6 pins), GPIO (19 pins)
5V OUT: Power (8 pins), USB (P17.1)
GND: MCU (14 pins), Power (17 pins), Oscillators (C16.2 C17.2), RS232 (9 pins), USB (D6.2 D7.2 P17.2), ADC (D8.2 D9.2 R36.2 R37.2), DAC (7 pins), GPIO (58 pins)
_BSY: MCU (U1.20), DAC (R42.2 U5.5)
_LDAC: MCU (U1.39), DAC (U5.4)
ADC12_IN8: MCU (U1.18), ADC (R34.1 R36.1)
ADC12_IN9: MCU (U1.19), ADC (R35.1 R37.1)
HSE_IN/OUT: MCU (U1.5), Oscillators (C16.1 Y1.1)
HSE_OUT/IN: MCU (U1.6), Oscillators (C17.1 Y1.2)
PA0: MCU (U1.10), GPIO (5 pins)
PA1: MCU (U1.11), GPIO (5 pins)
PA2: MCU (U1.12), GPIO (6 pins)
PA3: MCU (U1.13), GPIO (5 pins)
PA4: MCU (U1.14), GPIO (5 pins)
PA5: MCU (U1.15), GPIO (5 pins)
PA6: MCU (U1.16), GPIO (5 pins)
PA7: MCU (U1.17), GPIO (5 pins)
PA8: MCU (U1.29), GPIO (5 pins)
PB4: MCU (U1.40), GPIO (5 pins)
PB5: MCU (U1.41), GPIO (5 pins)
PB6: MCU (U1.42), GPIO (5 pins)
PB7: MCU (U1.43), GPIO (5 pins)
PB8: MCU (U1.45), GPIO (5 pins)
PB9: MCU (U1.46), GPIO (5 pins)
PB12: MCU (U1.25), GPIO (5 pins)
PB13: MCU (U1.26), GPIO (5 pins)
PB14: MCU (U1.27), GPIO (5 pins)
PB15: MCU (U1.28), GPIO (5 pins)
RX1: MCU (U1.31), RS232 (D2.1 U4.12)
SCL: MCU (U1.21), DAC (R40.2 U5.2)
SDA: MCU (U1.22), DAC (R41.2 U5.3)
TX1: MCU (U1.30), RS232 (D4.1 U4.11)
USBD_N: MCU (U1.32), USB (D7.1 P18.1)
USBD_P: MCU (U1.33), USB (D6.1 P18.2)